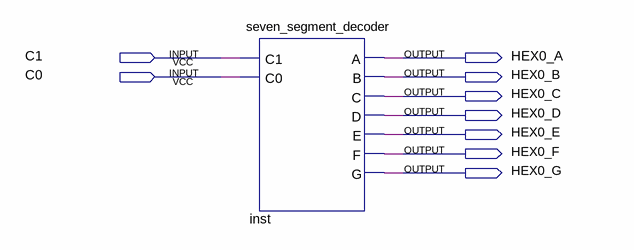
[diagram p0: schematic sheet]
// Quartus schematic task.bdf as structural Verilog: 1 symbols, 9 pins
module \task  (
  input  C1,
  input  C0,
  output HEX0_A,
  output HEX0_B,
  output HEX0_C,
  output HEX0_D,
  output HEX0_E,
  output HEX0_F,
  output HEX0_G
);

  seven_segment_decoder inst (
    .C1(C1), .C0(C0), .A(HEX0_A), .B(HEX0_B), .C(HEX0_C), .D(HEX0_D), .E(HEX0_E), .F(HEX0_F), .G(HEX0_G));
endmodule
